# EAGLE schematic Eagle_Schematic_Copagetec_Project (EAGLE 7.6.0)

## Sheet 1 of 2: PAGE2
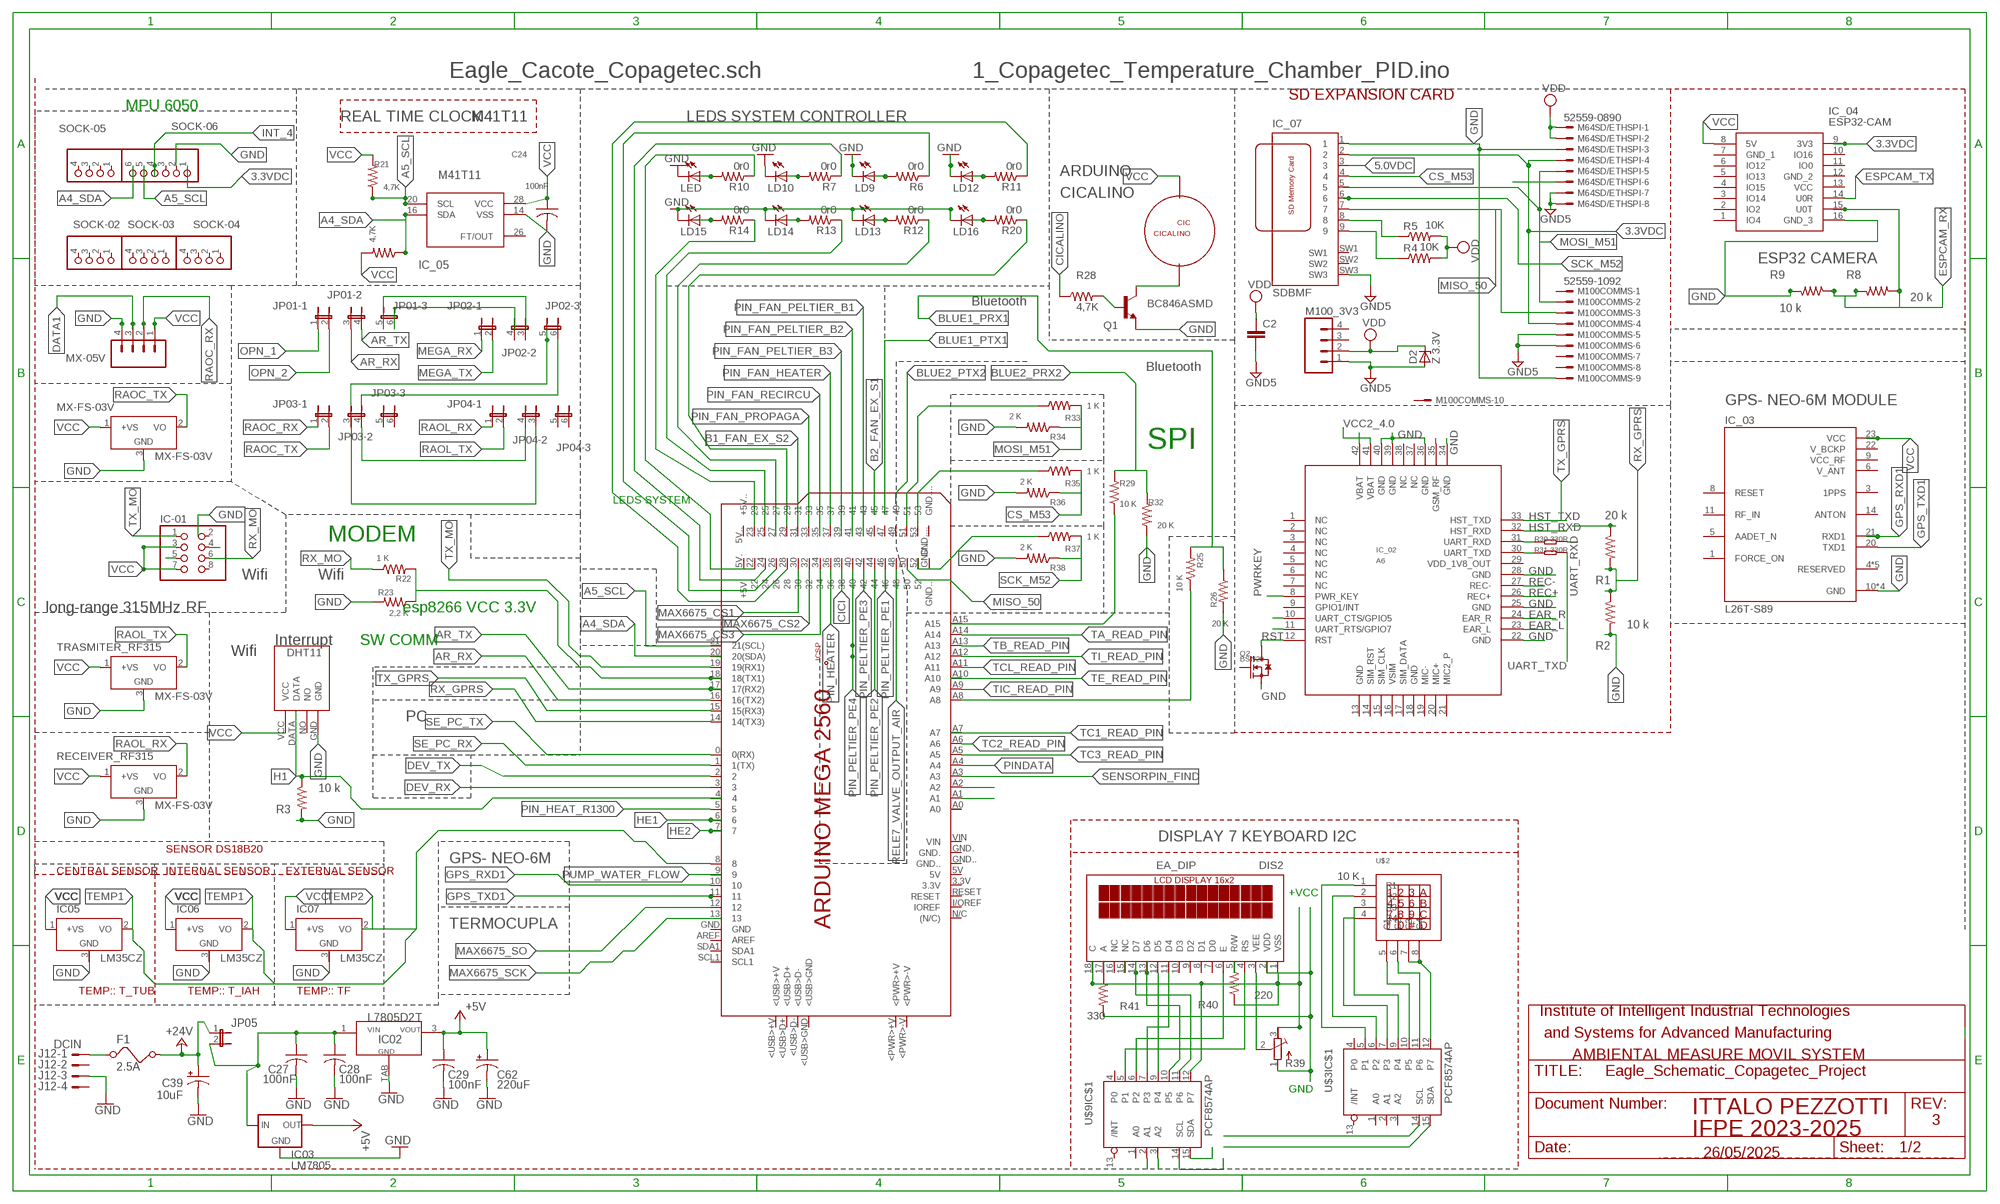
[diagram p0: schematic, sheet 1]

### Parts
C2  100nF  C-EUC0805K  [C0805K@1]
C24  100nF  C-USC0805  [C0805]
C27  100nF  C-USC0805  [C0805]
C28  100nF  C-USC0805  [C0805]
C29  100nF  C-USC0805  [C0805]
C39  10uF  CPOL-USC/6032-28R  [C/6032-28R]
C62  220uF  CPOL-US153CLV-0605  [153CLV-0605]
CICALINO  CIC  [CIC]
D2  Z 3.3V  ZENER-DIODESMB  [SMB]
DIS2  EA_DIP  [EA_DIP]
F1  2.5A  FUSE  [FUSE]
IC02  L7805D2T  [TO263-2]
IC03  LM7805  78XXS  [78XXS]
IC05  LM35CZ  [TO92]
IC06  LM35CZ  [TO92]
IC07  LM35CZ  [TO92]
IC-01  PINHD-2X4  [2X04]
IC_02  A6  [A6]
IC_03  L26T-S89  [XCVR_L26T-S89]
IC_04  ESP32-CAM  [ESP32-CAM]
IC_05  M41T11  [SOH28]
IC_07  SDBMF  [SDBMF-009XXBXX2]
J12  DCIN  PANDUIT_2.54X4  [PANDUIT_2.54X4]
JP01  JP3QE  [JP3Q]
JP02  JP3QE  [JP3Q]
JP03  JP3QE  [JP3Q]
JP04  JP3QE  [JP3Q]
JP05  JP1E  [JP1]
LD9  LED3MM  [LED3MM]
LD10  LED3MM  [LED3MM]
LD12  LED3MM  [LED3MM]
LD13  LED3MM  [LED3MM]
LD14  LED3MM  [LED3MM]
LD15  LED3MM  [LED3MM]
LD16  LED3MM  [LED3MM]
LED  LED3MM  [LED3MM]
M64SD/ETHSPI  52559-0890  [52559-0890]
M100_3V3  M04  [04P]
M100COMMS  52559-1092  [52559-1092]
MX-05V  M04  [04P]
MX-FS-03V  MX-FS-03V  LM35CZ  [TO92]
PCB1  ARDUINO_MEGA2560  [ARDUINO_MEGA2560]
Q1  BC846ASMD  [SOT23]
Q2  BSN20  MOSFET-N'SOT23'  [SOT23@1]
R1  20 k  R-US_M0805  [M0805]
R2  10 k  R-US_M0805  [M0805]
R3  10 k  R-US_M0805  [M0805]
R4  10K  R-US_M0805  [M0805]
R5  10K  R-US_M0805  [M0805]
R6  0r0  R-US_M0805  [M0805]
R7  0r0  R-US_M0805  [M0805]
R8  20 k  R-US_M0805  [M0805]
R9  10 k  R-US_M0805  [M0805]
R10  0r0  R-US_M0805  [M0805]
R11  0r0  R-US_M0805  [M0805]
R12  0r0  R-US_M0805  [M0805]
R13  0r0  R-US_M0805  [M0805]
R14  0r0  R-US_M0805  [M0805]
R20  0r0  R-US_M0805  [M0805]
R21  4,7K  R-US_M0805  [M0805]
R22  1 K  R-US_M0805  [M0805]
R23  2,2 K  R-US_M0805  [M0805]
R25  10 K  R-US_M0805  [M0805]
R26  20 K  R-US_M0805  [M0805]
R27  4,7K  R-US_M0805  [M0805]
R28  4,7K  R-US_M0805  [M0805]
R29  10 K  R-US_M0805  [M0805]
R30  330R  R-0603  [R0603]
R31  330R  R-0603  [R0603]
R32  20 K  R-US_M0805  [M0805]
R33  1 K  R-US_M0805  [M0805]
R34  2 K  R-US_M0805  [M0805]
R35  1 K  R-US_M0805  [M0805]
R36  2 K  R-US_M0805  [M0805]
R37  1 K  R-US_M0805  [M0805]
R38  2 K  R-US_M0805  [M0805]
R39  10 K  R-TRIMM64W  [RTRIM64W]
R40  220  R-US_0309/10  [0309/10]
R41  330  R-US_0309/10  [0309/10]
RECEIVER_RF315  MX-FS-03V  LM35CZ  [TO92]
SOCK-02  PINHD-1X4  [1X04]
SOCK-03  PINHD-1X4  [1X04]
SOCK-04  PINHD-1X4  [1X04]
SOCK-05  PINHD-1X4  [1X04]
SOCK-06  PINHD-1X6_2.00  [1X06M]
TRASMITER_RF315  MX-FS-03V  LM35CZ  [TO92]
U$2  KEYPAD4X4  [KEYPAD4X4]
U$3  PCF8574AP  [DIL16]
U$9  PCF8574AP  [DIL16]
U$12  DHT11  [DHT11]

### Nets
3.3VDC: IC_04.9(3V3) IC_07.2 M64SD/ETHSPI.4 M100COMMS.4 SOCK-06.1
5.0VDC: IC_07.3
+5V: C29.1 C62.+ IC02.3(VOUT) IC03.OUT
+24V: C39.+ F1.2 JP05.1
A4_SDA: IC_05.16(SDA) PCB1.20(20(SDA)) R27.1 SOCK-06.6
A5_SCL: IC_05.20(SCL) PCB1.21(21(SCL)) R21.1 SOCK-06.5
AR_RX: JP01.3 PCB1.16(16(TX2))
AR_TX: JP01.4 PCB1.17(17(RX2))
ARME_M51: R33.1
ARME_M52: PCB1.52 R37.1
ARME_M53: R35.1
BLUE1_PRX1: R25.2 R26.1
BLUE2_PRX2: R29.2 R32.1
CICALINO: R28.1
CS_M53: IC_07.4 R35.2 R36.1
DATA1: MX-05V.3
DEV_RX: PCB1.3
DEV_TX: PCB1.2
EAR_L: IC_02.23(EAR_L)
EAR_R: IC_02.24(EAR_R)
ESPCAM_RX: IC_04.15(U0T) R8.1 R8.2 R9.1
ESPCAM_TX: IC_04.14(U0R)
GND: C24.2 C27.2 C28.2 C29.2 C39.- C62.- IC02.TAB(GND) IC03.GND IC05.3(GND) IC06.3(GND) IC07.3(GND) IC_02.22(GND) IC_02.25(GND) IC_02.28(GND) IC_02.34(GND) IC_02.36(GND) IC_02.39(GND) IC_02.40(GND) IC_03.10(GND) IC_03.12(GND) IC_03.13(GND) IC_03.24(GND) IC_04.16(GND_3) IC_05.14(VSS) IC_07.1 J12.3 LD10.K(C) LD15.K(C) LED.K(C) M64SD/ETHSPI.3 M100COMMS.9 MX-05V.4 MX-FS-03V.3(GND) Q1.2(E) Q2.2(S) R9.2 R23.2 R26.2 R32.2 RECEIVER_RF315.3(GND) SOCK-06.2 TRASMITER_RF315.3(GND) U$12.GND
GND5: C2.2 D2.A IC_07.SW3 M64SD/ETHSPI.7 M64SD/ETHSPI.8 M100_3V3.1 M100COMMS.5 M100COMMS.6
GPS_RXD1: IC_03.21(RXD1) PCB1.10
GPS_TXD1: IC_03.20(TXD1) PCB1.11
GSM_RF: IC_02.35(GSM_RF)
H1: PCB1.4 R3.1 U$12.DATA
HE1: PCB1.6
HE2: PCB1.7
HST_RXD: IC_02.32(HST_RXD)
HST_TXD: IC_02.33(HST_TXD)
INT_4: SOCK-06.4
MAX6675_SCK: PCB1.13
MAX6675_SO: PCB1.12
MEGA_RX: JP02.1
MEGA_TX: JP02.2
MISO_50: IC_07.7 M100COMMS.3
MOSI_M51: M64SD/ETHSPI.5 M100COMMS.2 R33.2 R34.1
N$1: IC_07.5
N$5: R3.2
N$7: F1.1 J12.1
N$8: IC_02.31(UART_RXD) R30.1
N$9: IC_02.30(UART_TXD) R31.1
N$10: R1.2 R2.1
N$13: IC_07.8 R5.1
N$14: R1.1
N$16: R2.2
N$17: IC_07.9 R4.1
N$18: M64SD/ETHSPI.6
N$19: PCB1.A0
N$20: Q1.1(B) R28.2
N$24: LD9.A R6.2
N$27: CICALINO.P$1 Q1.3(C)
N$31: LD10.A R7.2
N$35: PCB1.A2
N$36: LED.A R10.2
N$37: R14.1
N$38: R34.2
N$39: R36.2
N$40: R13.1
N$41: LD12.A R11.2
N$42: LD13.A R12.2
N$43: JP01.6
N$44: JP02.5
N$45: JP02.6
N$46: PCB1.27 R12.1
N$47: JP03.4 JP04.4
N$48: JP03.3 JP04.3
N$49: R20.1
N$50: JP01.5
N$51: R38.2
N$52: U$2.7(C3) U$2.8(C4) U$3.12(IC$1:P7)
N$53: U$2.6(C2) U$3.11(IC$1:P6)
N$56: U$2.5(C1) U$3.10(IC$1:P5)
N$57: R10.1
N$58: R7.1
N$59: R6.1
N$60: R11.1
N$61: U$2.3(R3) U$3.9(IC$1:P4)
N$62: U$2.4(R4) U$3.7(IC$1:P3)
N$63: U$2.2(R2) U$3.6(IC$1:P2)
N$64: U$2.1(R1) U$3.5(IC$1:P1)
N$65: LD14.A R13.2
N$66: LD15.A R14.2
N$67: LD16.A R20.2
N$68: DIS2.15(NC)
N$69: DIS2.13(D6) U$9.10(IC$1:P5)
N$70: DIS2.3(VEE) R39.2(S)
N$71: DIS2.14(D7) U$9.11(IC$1:P6)
N$72: DIS2.4(RS) U$9.5(IC$1:P1)
N$73: DIS2.5(R/W) R40.2
N$74: U$9.14(IC$1:SCL)
N$75: U$9.15(IC$1:SDA)
N$76: PCB1.A1
N$80: DIS2.11(D4) U$9.7(IC$1:P3)
N$81: DIS2.12(D5) U$9.9(IC$1:P4)
N$84: IC-01.4
N$85: IC-01.5
N$86: DIS2.17(A) R41.1
N$87: DIS2.1(VSS) DIS2.18(C) R39.3(E) R40.1 U$9.12(IC$1:P7)
N$89: DIS2.2(VDD) R39.1(A) R41.2
N$90: U$3.15(IC$1:SDA)
N$91: U$3.14(IC$1:SCL)
N$100: DIS2.6(E) U$9.6(IC$1:P2)
N$101: LD9.K(C) LD12.K(C) LD13.K(C) LD14.K(C) LD16.K(C) ; supply symbol labelled GND
N$102: U$9.3(IC$1:A2)
N$103: U$9.2(IC$1:A1)
N$133: C27.1 C28.1 IC02.1(VIN) IC03.IN JP05.2
OPN_1: JP01.1
OPN_2: JP01.2
PIN_FAN_PELTIER_B1: PCB1.43
PIN_FAN_PELTIER_B2: PCB1.41
PIN_FAN_PELTIER_B3: PCB1.39
PIN_FAN_RECIRCU: PCB1.35
PIN_HEAT_R1300: PCB1.5
PIN_PELTIER_PE4: PCB1.GND__ PCB1.RESET.
PINDATA: PCB1.A4
PWRKEY: IC_02.8(PWR_KEY)
RAOC_RX: JP03.1 MX-05V.2
RAOC_TX: JP03.2 MX-FS-03V.2(VO)
RAOL_RX: JP04.1 RECEIVER_RF315.2(VO)
RAOL_TX: JP04.2 TRASMITER_RF315.2(VO)
REC+: IC_02.26(REC+)
REC-: IC_02.27(REC-)
RST: IC_02.12(RST) Q2.3(D)
RX_GPRS: PCB1.14(14(TX3))
RX_MO: IC-01.6 R22.1
RX_MO1: PCB1.A8 R25.1
RX_MO2: PCB1.A15 R29.1
SCK_M52: IC_07.6 R37.2 R38.1
SE_PC_RX: PCB1.1(1(TX))
SE_PC_TX: PCB1.0(0(RX))
SENSORPIN_FIND: PCB1.A3
TA_READ_PIN: PCB1.A14
TB_READ_PIN: PCB1.A13
TC1_READ_PIN: PCB1.A7
TC2_READ_PIN: PCB1.A6
TC3_READ_PIN: PCB1.A5
TCL_READ_PIN: PCB1.A11
TE_READ_PIN: PCB1.A10
TEMP1: IC05.2(VO) IC06.2(VO) PCB1.8
TEMP2: IC07.2(VO)
TI_READ_PIN: PCB1.A12
TIC_READ_PIN: PCB1.A9
TX1_ARMEGA: PCB1.18(18(TX1)) R22.2 R23.1
TX_GPRS: PCB1.15(15(RX3))
TX_MO: IC-01.1 PCB1.19(19(RX1))
UART_CTS: IC_02.10(UART_CTS/GPIO5)
UART_RTS: IC_02.11(UART_RTS/GPIO7)
UART_RXD: R30.2
UART_TXD: R31.2
VCC: C24.1 CICALINO.P$2 IC05.1(+VS) IC06.1(+VS) IC07.1(+VS) IC-01.3 IC-01.7 IC_03.23(VCC) IC_04.8(5V) IC_05.28(VCC) MX-05V.1 MX-FS-03V.1(+VS) R21.2 R27.2 RECEIVER_RF315.1(+VS) TRASMITER_RF315.1(+VS) U$12.VCC
VCC2_4.0: IC_02.41(VBAT) IC_02.42(VBAT)
VDD: C2.1 D2.C M64SD/ETHSPI.1 M64SD/ETHSPI.2 M100_3V3.2 R4.2 R5.2 ; also sheet 2
Unconnected: DIS2.7(D0) DIS2.8(D1) DIS2.9(D2) DIS2.10(D3) DIS2.16(NC) IC-01.2 IC-01.8 IC_02.1(NC) IC_02.2(NC) IC_02.3(NC) IC_02.4(NC) IC_02.5(NC) IC_02.6(NC) IC_02.7(NC) IC_02.9(GPIO1/INT) IC_02.13(GND) IC_02.14(SIM_RST) IC_02.15(SIM_CLK) IC_02.16(VSIM) IC_02.17(SIM_DATA) IC_02.18(GND) IC_02.19(MIC-) IC_02.20(MIC+) IC_02.21(MIC2_P) IC_02.29(VDD_1V8_OUT) IC_02.37(NC) IC_02.38(NC) IC_03.1(FORCE_ON) IC_03.3(1PPS) IC_03.4(RESERVED) IC_03.5(AADET_N) IC_03.8(RESET) IC_03.11(RF_IN) IC_03.14(ANTON) IC_03.15(RESERVED) IC_03.16(RESERVED) IC_03.18(RESERVED) IC_03.19(RESERVED) IC_04.1(IO4) IC_04.2(IO2) IC_04.3(IO14) IC_04.4(IO15) IC_04.5(IO13) IC_04.6(IO12) IC_04.7(GND_1) IC_04.10(IO16) IC_04.11(IO0) IC_04.12(GND_2) IC_04.13(VCC) IC_05.26(FT/OUT) IC_07.SW1 IC_07.SW2 J12.2 J12.4 JP02.3 JP02.4 JP03.5 JP03.6 JP04.5 JP04.6 M100_3V3.3 M100_3V3.4 M100COMMS.1 M100COMMS.7 M100COMMS.8 M100COMMS.10 PCB1.3.3V PCB1.5V PCB1.5V.(+5V.) PCB1.5V..(+5V..) PCB1.9 PCB1.22 PCB1.23 PCB1.24 PCB1.25 PCB1.26 PCB1.28 PCB1.29 PCB1.30 PCB1.31 PCB1.32 PCB1.33 PCB1.34 PCB1.36 PCB1.37 PCB1.38 PCB1.40 PCB1.42 PCB1.44 PCB1.45 PCB1.46 PCB1.47 PCB1.48 PCB1.49 PCB1.50 PCB1.51 PCB1.53 PCB1.+5V_ PCB1.<PWR>+V PCB1.<PWR>-V PCB1.<USB>+V PCB1.<USB>D+ PCB1.<USB>D- PCB1.<USB>GND PCB1.AREF PCB1.GND PCB1.GND. PCB1.GND.. PCB1.GND... PCB1.GND.... PCB1.I/OREF(IOREF) PCB1.MISO PCB1.MOSI PCB1.N/C((N/C)) PCB1.RESET PCB1.SCK PCB1.SCL1 PCB1.SDA1 PCB1.VIN Q2.1(G) SOCK-02.1 SOCK-02.2 SOCK-02.3 SOCK-02.4 SOCK-03.1 SOCK-03.2 SOCK-03.3 SOCK-03.4 SOCK-04.1 SOCK-04.2 SOCK-04.3 SOCK-04.4 SOCK-05.1 SOCK-05.2 SOCK-05.3 SOCK-05.4 SOCK-06.3 U$3.1(IC$1:A0) U$3.2(IC$1:A1) U$3.3(IC$1:A2) U$3.4(IC$1:P0) U$3.13(IC$1:/INT) U$9.1(IC$1:A0) U$9.4(IC$1:P0) U$9.13(IC$1:/INT) U$12.NO

### Notes on the sheet
- Eagle_Cacote_Copagetec.sch | 1_Copagetec_Temperature_Chamber_PID.ino
- MPU 6050 | SD EXPANSION CARD
- LEDS SYSTEM CONTROLLER
- REAL TIME CLOCK | M41T11
- ARDUINO
- CICALINO
- ESP32 CAMERA
- Bluetooth
- Bluetooth
- GPS- NEO-6M MODULE
- SPI
- LEDS SYSTEM
- MODEM
- Wifi | Wifi
- esp8266 VCC 3.3V
- long-range 315MHz RF
- SW COMM
- Interrupt
- Wifi
- PC
- DISPLAY 7 KEYBOARD I2C
- SENSOR DS18B20
- GPS- NEO-6M
- CENTRAL SENSOR | INTERNAL SENSOR | EXTERNAL SENSOR
- +VCC
- TERMOCUPLA
- TEMP:: T_TUB | TEMP:: T_IAH | TEMP:: TF
- Institute of Intelligent Industrial Technologies
- and Systems for Advanced Manufacturing
- AMBIENTAL MEASURE MOVIL SYSTEM
- GND
- ITTALO PEZZOTTI
- 3
- IFPE 2023-2025
- 26/05/2025

## Sheet 2 of 2
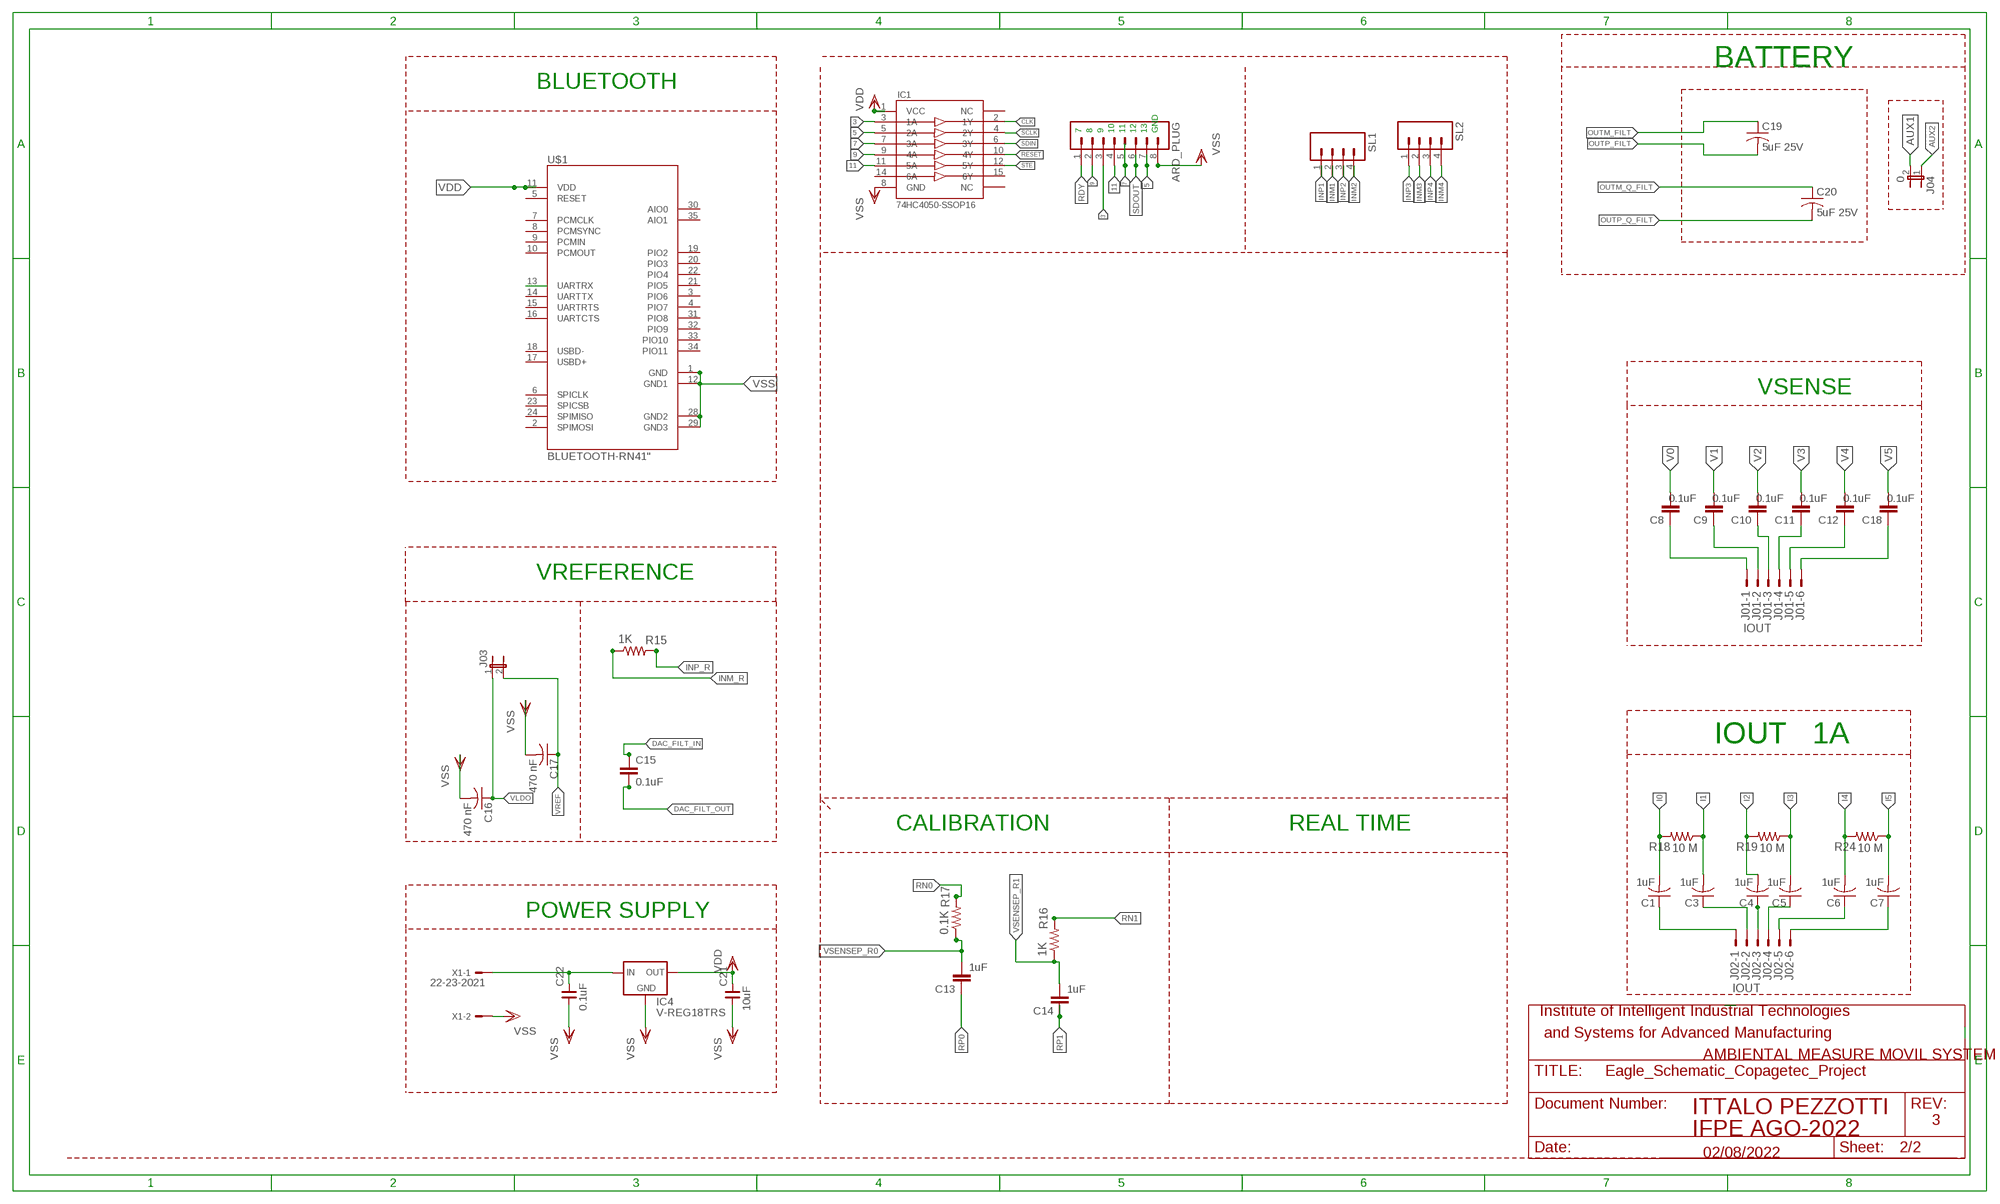
[diagram p1: schematic, sheet 2]

### Parts
ARD_PLUG  M08  [08P]
C1  1uF  C-USC2012  [C2012]
C3  1uF  C-USC2012  [C2012]
C4  1uF  C-USC2012  [C2012]
C5  1uF  C-USC2012  [C2012]
C6  1uF  C-USC2012  [C2012]
C7  1uF  C-USC2012  [C2012]
C8  0.1uF  C-EUC0805K  [C0805K@1]
C9  0.1uF  C-EUC0805K  [C0805K@1]
C10  0.1uF  C-EUC0805K  [C0805K@1]
C11  0.1uF  C-EUC0805K  [C0805K@1]
C12  0.1uF  C-EUC0805K  [C0805K@1]
C13  1uF  C-EUC0805K  [C0805K@1]
C14  1uF  C-EUC0805K  [C0805K@1]
C15  0.1uF  C-EUC0805K  [C0805K@1]
C16  470 nF  C-USC2012  [C2012]
C17  470 nF  C-USC2012  [C2012]
C18  0.1uF  C-EUC0805K  [C0805K@1]
C19  5uF 25V  C-USC2012  [C2012]
C20  5uF 25V  C-USC2012  [C2012]
C21  10uF  C_1206  [C1206]
C22  0.1uF  C_0805  [C0805]
IC1  74HC4050-SSOP16  [TSSOP16]
IC4  V-REG18TRS  [SOT223]
J01  IOUT  PANDUIT_2.54X6  [PANDUIT_2.54X6]
J02  IOUT  PANDUIT_2.54X6  [PANDUIT_2.54X6]
J03  JP1E  [JP1]
J04  0  JP1E  [JP1]
R15  1K  R-US_M0805  [M0805]
R16  1K  R-US_M0805  [M0805]
R17  0.1K  R-US_M0805  [M0805]
R18  10 M  R-US_M0805  [M0805]
R19  10 M  R-US_M0805  [M0805]
R24  10 M  R-US_M0805  [M0805]
SL1  M04  [04P]
SL2  M04  [04P]
U$1  BLUETOOTH-RN41"  [RN41]
X1  22-23-2021  [22-23-2021]

### Nets
3: ARD_PLUG.3 IC1.3(1A)
5: ARD_PLUG.7 IC1.5(2A)
7: ARD_PLUG.5 IC1.7(3A)
9: ARD_PLUG.2 IC1.9(4A)
11: ARD_PLUG.4 IC1.11(5A)
AUX1: J04.2
AUX2: J04.1
CLK: IC1.2(1Y)
DAC_FILT_IN: C15.1
DAC_FILT_OUT: C15.2
I0: C1.2 R18.2
I1: C3.2 R18.1
I2: C4.2 R19.2
I3: C5.2 R19.1
I4: C6.2 R24.2
I5: C7.2 R24.1
INM1: SL1.2
INM2: SL1.4
INM3: SL2.2
INM4: SL2.4
INM_R: R15.1
INP1: SL1.1
INP2: SL1.3
INP3: SL2.1
INP4: SL2.3
INP_R: R15.2
N$4: C4.1 J02.3
N$6: C5.1 J02.4
N$11: C7.1 J02.6
N$12: C3.1 J02.2
N$21: C1.1 J02.1
N$22: C6.1 J02.5
N$23: C8.1 J01.1
N$25: C9.1 J01.2
N$26: C10.1 J01.3
N$30: C11.1 J01.4
N$32: C12.1 J01.5
N$33: C18.1 J01.6
N$34: C22.2 IC4.3(IN) X1.1
OUTM_FILT: C19.1
OUTM_Q_FILT: C20.1
OUTP_FILT: C19.2
OUTP_Q_FILT: C20.2
RDY: ARD_PLUG.1
RESET: IC1.10(4Y)
RN0: R17.2
RN1: R16.2
RP0: C13.1
RP1: C14.1
RX: U$1.13(UARTRX)
SCLK: IC1.4(2Y)
SDIN: IC1.6(3Y)
SDOUT: ARD_PLUG.6
STE: IC1.12(5Y)
V0: C8.2
V1: C9.2
V2: C10.2
V3: C11.2
V4: C12.2
V5: C18.2
VDD: C21.2 IC1.1(VCC) IC4.4(OUT) U$1.11(VDD) ; also sheet 1
VLDO: C16.1 J03.1
VREF: C17.1 J03.2
VSENSEP_R0: C13.2 R17.1
VSENSEP_R1: C14.2 R16.1
VSS: ARD_PLUG.8 C16.2 C17.2 C21.1 C22.1 IC1.8(GND) IC4.1(GND) U$1.1(GND) U$1.12(GND1) U$1.28(GND2) U$1.29(GND3) X1.2
Unconnected: IC1.13(NC) IC1.14(6A) IC1.15(6Y) IC1.16(NC) U$1.2(SPIMOSI) U$1.3(PIO6) U$1.4(PIO7) U$1.5(RESET) U$1.6(SPICLK) U$1.7(PCMCLK) U$1.8(PCMSYNC) U$1.9(PCMIN) U$1.10(PCMOUT) U$1.14(UARTTX) U$1.15(UARTRTS) U$1.16(UARTCTS) U$1.17(USBD+) U$1.18(USBD-) U$1.19(PIO2) U$1.20(PIO3) U$1.21(PIO5) U$1.22(PIO4) U$1.23(SPICSB) U$1.24(SPIMISO) U$1.30(AIO0) U$1.31(PIO8) U$1.32(PIO9) U$1.33(PIO10) U$1.34(PIO11) U$1.35(AIO1)

### Notes on the sheet
- BATTERY
- BLUETOOTH
- 7 | 8 | 9 | 10 | 11 | 12 | 13 | GND
- VSENSE
- VREFERENCE
- IOUT | 1A
- CALIBRATION | REAL TIME
- POWER SUPPLY
- Institute of Intelligent Industrial Technologies
- and Systems for Advanced Manufacturing
- AMBIENTAL MEASURE MOVIL SYSTEM
- ITTALO PEZZOTTI
- 3
- IFPE AGO-2022
- 02/08/2022

## Power pins joined to a net without a drawn wire
GND: U$3.8(PWR:GND) U$9.8(PWR:GND)
V_ANT: IC_03.6(V_ANT)
V_BCKP: IC_03.22(V_BCKP)
VCC: U$3.16(PWR:VCC) U$9.16(PWR:VCC)
VCC_RF: IC_03.9(VCC_RF)

## Library data of the parts
ARD_PLUG = con-amp-quick:M08: AMP QUICK CONNECTOR; OC_FARNELL: unknown; OC_NEWARK: unknown
C1 C3-C7 C16 C17 C19 C20 C24 C27-C29 = rcl:C-US: CAPACITOR, American symbol
C2 C8-C15 C18 = rcl:C-EU: CAPACITOR, European symbol
C21 C22 = rc-master:C_: NON-POLARIZED CAP
C39 C62 = rcl:CPOL-US: POLARIZED CAPACITOR, American symbol
CICALINO = ST m41:CIC
D2 = diode:ZENER-DIODE: Z-Diode
DIS2 = display-lcd:EA_DIP: LCD-MODUL 2x16 - 6,68mm, INKL. KONTROLLER HD44780 Source: Data sheet <http://www.lcd-module.de/pdf/doma/dip162-d.pdf>
F1 = special:FUSE: FUSE 5 x 20 mm
IC1 = 74HC4050D_Nerius:74HC4050-SSOP16
IC02 = digital_pots_ad:L7805
IC03 = v-reg:78XXS: VOLTAGE REGULATOR
IC4 = WSN:V-REG: Low drop fixed and adjustable positive voltage regulators 1 A Source: http://www.st.com/stonline/products/literature/ds/7194/ld1117axx.pdf
IC05-IC07 MX-FS-03V RECEIVER_RF315 TRASMITER_RF315 = lm35:LM35: Single-Supply Centigrade Temperature Sensor Vout = (10mV/°C x Temp °C) +5mmmV Source: http://www.national.com/ds/LM/LM35.pdf
IC-01 = pinhead:PINHD-2X4: PIN HEADER
IC_02 = IC:A6
IC_03 = L26T-S89:L26T-S89: Check prices <https://pricing.snapeda.com/parts/L26T-S89/Quectel/view-part?ref=eda> Check prices <https://pricing.snapeda.com/parts/L26T-S89/Quectel/view-part?ref=eda> Check availability <https://pricing.snapeda.com/parts/L26T-S89/Quectel/view-part?ref=eda>; AVAILABILITY: In Stock; DESCRIPTION: L26 is a concurrent receiver module integrated with multiple systems. It provides simultaneous GPS, GLONASS, Galileo and QZSS open service L1 reception capability; MF: Quectel; MP: L26T-S89; PACKAGE: Custom Quectel; PRICE: None; PURCHASE-URL: https://pricing.snapeda.com/search/part/L26T-S89/?ref=eda
IC_04 = ESP32-CAM:ESP32-CAM: Modules PCBA Module RoHS Source: Datasheet <https://datasheet.lcsc.com/szlcsc/Ai-Thinker-ESP32-CAM_C277946.pdf> Check availability <https://pricing.snapeda.com/parts/ESP32-CAM/AI-Thinker/view-part?ref=eda>; AVAILABILITY: In Stock; DESCRIPTION: ESP32 ESP32 Transceiver; 802.11 a/b/g/n (Wi-Fi, WiFi, WLAN), Bluetooth® Smart 4.x Low Energy (BLE) Evaluation Board; MF: AI-Thinker; MP: ESP32-CAM; PACKAGE: None; PRICE: None; PURCHASE-URL: https://pricing.snapeda.com/search/part/ESP32-CAM/?ref=eda
IC_05 = ST m41:M41T11
IC_07 = farnell:SDBMF: SD MEMORY CARD PUSH-PUSH WITH CONNECTOR TYPE B (BIG SWUÌTCH #3) KINGFONT PRECISION INDUSTIAL CO., LTD Source: http://www.farnell.com/datasheets/74273.pdf Best.-Nr.: 9186174 Hersteller: MULTICOMP Herstellerbez.: SDBMF-00915B0T2
J01 J02 = digital_pots_ad:PANDUIT_2.54X6: .100" (2.54mm) Center Header - 6 Pin
J03 J04 JP05 = jumper:JP1E: JUMPER
J12 = digital_pots_ad:PANDUIT_2.54X4: .100" (2.54mm) Center Header - 4 Pin
JP01-JP04 = jumper:JP3QE: JUMPER
LD9 LD10 LD12-LD16 LED = led:LED: LED OSRAM: - CHIPLED LG R971, LG N971, LY N971, LG Q971, LY Q971, LO R971, LY R971 LH N974, LH R974 LS Q976, LO Q976, LY Q976 LO Q996 - Hyper CHIPLED LW Q18S LB Q993, LB Q99A, LB R99A - SideLED LS A670, LO A670, LY A670, LG A670, LP A670 LB A673, LV A673, LT A673, LW A673 LH A674 LY A675 LS A676, LA A676, LO A676, LY A676, LW A676 LS A679, LY A679, LG A679 - Hyper Micro SIDELED® LS Y876, LA Y876, LO Y876, LY Y876 LT Y87S - SmartLED LW L88C, LW L88S LB L89C, LB L89S, LG L890 LS L89K, LO L89K, LY L89K LS L896, LA L896, LO L896, LY L896 - TOPLED LS T670, LO T670, LY T670, LG T670, LP T670 LSG T670, LSP T670, LSY T670, LOP T670, LYG T670 LG T671, LOG T671, LSG T671 LB T673, LV T673, LT T673, LW T673 LH T674 LS T676, LA T676, LO T676, LY T676, LB T676, LH T676, LSB T676, LW T676 LB T67C, LV T67C, LT T67C, LS T67K, LO T67K, LY T67K, LW E67C LS E67B, LA E67B, LO E67B, LY E67B, LB E67C, LV E67C, LT E67C LW T67C LS T679, LY T679, LG T679 LS T770, LO T770, LY T770, LG T770, LP T770 LB T773, LV T773, LT T773, LW T773 LH T774 LS E675, LA E675, LY E675, LS T675 LS T776, LA T776, LO T776, LY T776, LB T776 LHGB T686 LT T68C, LB T68C - Hyper Mini TOPLED® LB M676 - Mini TOPLED Santana® LG M470 LS M47K, LO M47K, LY M47K Source: http://www.osram.convergy.de - LUMILED® LXK2-PW12-R00, LXK2-PW12-S00, LXK2-PW14-U00, LXK2-PW14-V00 LXK2-PM12-R00, LXK2-PM12-S00, LXK2-PM14-U00 LXK2-PE12-Q00, LXK2-PE12-R00, LXK2-PE12-S00, LXK2-PE14-T00, LXK2-PE14-U00 LXK2-PB12-K00, LXK2-PB12-L00, LXK2-PB12-M00, LXK2-PB14-N00, LXK2-PB14-P00, LXK2-PB14-Q00 LXK2-PR12-L00, LXK2-PR12-M00, LXK2-PR14-Q00, LXK2-PR14-R00 LXK2-PD12-Q00, LXK2-PD12-R00, LXK2-PD12-S00 LXK2-PH12-R00, LXK2-PH12-S00 LXK2-PL12-P00, LXK2-PL12-Q00, LXK2-PL12-R00 Source: www.luxeon.com
M64SD/ETHSPI = con-molex:52559-0890: FFC/FPC-to-Board 0.50mm (.020") SMT, Vertical, ZIF Receptacle Source: http://www.molex.com/product/ffc/52559.html
M100_3V3 MX-05V SL1 SL2 = con-amp-quick:M04: AMP QUICK CONNECTOR
M100COMMS = con-molex:52559-1092: FFC/FPC-to-Board 0.50mm (.020") SMT, Vertical, ZIF Receptacle Source: http://www.molex.com/product/ffc/52559.html
PCB1 = E14_Arduino_revC:ARDUINO_MEGA2560: Device for representing an Arduino Mega 2560 board with a footprint in an EAGLE design. Created by Dave Young for Element14. More EAGLE documentation at: http://www.element14.com/community/community/knode/cadsoft_eagle
Q1 = transistor-npn:BC846*: NPN Transistor
Q2 = Discrete:MOSFET-N: IRLL014: http://www.vishay.com/docs/91319/sihll014.pdf
R1-R29 R32-R38 = rcl:R-US_: RESISTOR, American symbol
R30 R31 = Discrete:R*
R39 = resistor:R-TRIMM: Trimm resistor
R40 R41 = resistor:R-US_: RESISTOR, American symbol
SOCK-02-SOCK-05 = pinhead:PINHD-1X4: PIN HEADER
SOCK-06 = pinhead-1:PINHD-1X6: PIN HEADER
U$1 = SparkFun-RF:BLUETOOTH-RN41: Bluetooth SMD module
U$2 = keypad4x4_ece:KEYPAD4X4
U$3 U$9 = i2c:PCF8574: Remote 8-Bit I/O Expander for I²C Bus
U$12 = DHT11:DHT11: DHT11 Czujnik temperatury i wilgotności
X1 = con-molex:22-23-2021: .100" (2.54mm) Center Header - 2 Pin; MF: MOLEX; MPN: 22-23-2021; OC_FARNELL: 1462926; OC_NEWARK: 25C3832